# EAGLE design sparkfun-samd21-mini-breakout-v10 (EAGLE 9.2.2)
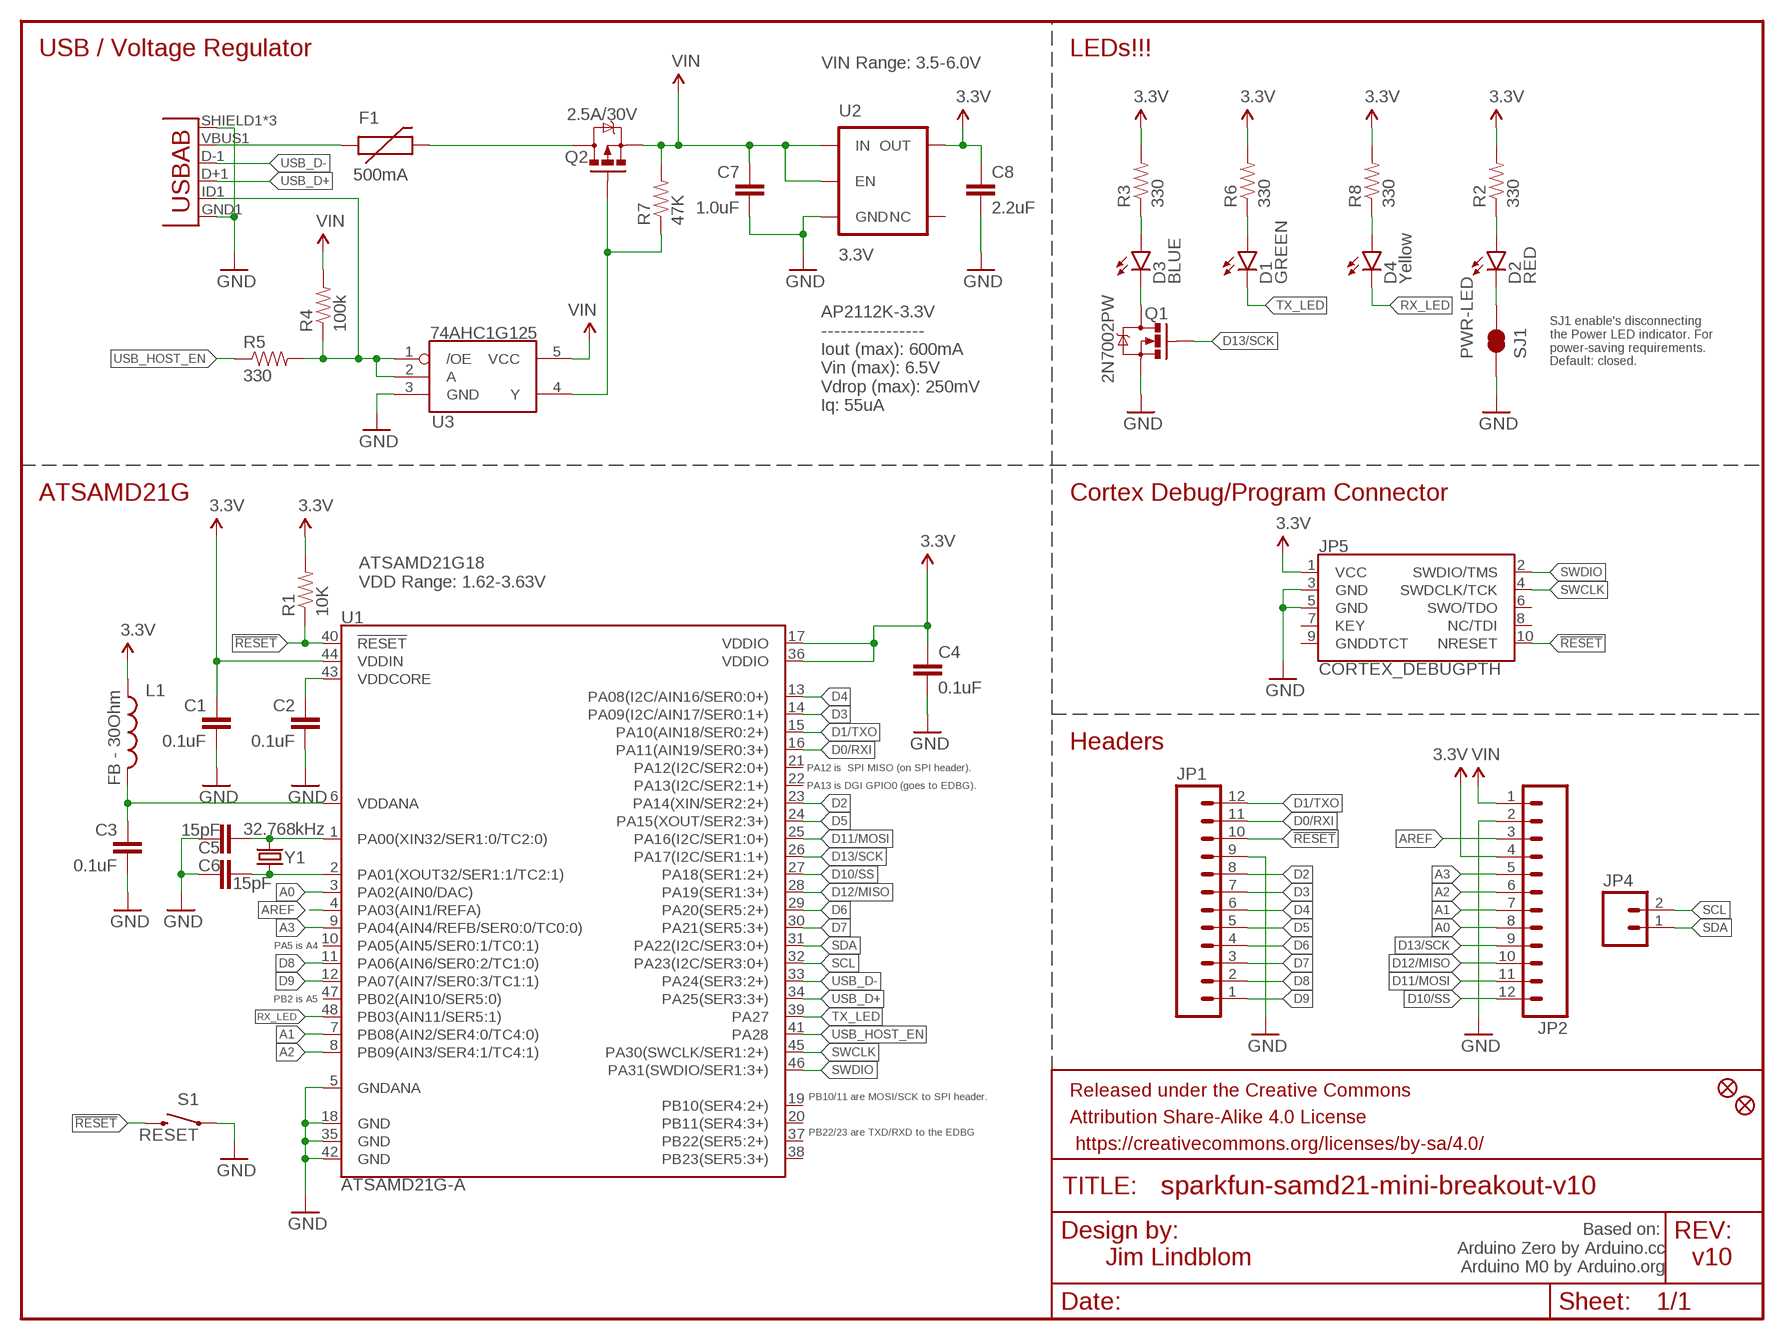
[diagram p0: schematic, sheet 1]

## Parts
C1  0.1uF  0.1UF-16V(+-10%)(0402)  [0402-CAP]
C2  0.1uF  0.1UF-16V(+-10%)(0402)  [0402-CAP]
C3  0.1uF  0.1UF-16V(+-10%)(0402)  [0402-CAP]
C4  0.1uF  0.1UF-16V(+-10%)(0402)  [0402-CAP]
C5  15pF  15PF-50V(+-5%)(0402)  [0402-CAP]
C6  15pF  15PF-50V(+-5%)(0402)  [0402-CAP]
C7  1.0uF  1.0UF-25V-+80/-20(0805)"  [0805-CAP]
C8  2.2uF  2.2UF-10V-20%(0603)  [0603-CAP]
D1  GREEN  LED-GREEN0603  [LED-0603]
D2  RED  LED-RED0603  [LED-0603]
D3  BLUE  LED-BLUE0603  [LED-0603]
D4  Yellow  LED-YELLOW0603  [LED-0603]
F1  500mA  PTCSMD  [PTC-1206]
FID1  FIDUCIAL1X2  [FIDUCIAL-1X2]
FID2  FIDUCIAL1X2  [FIDUCIAL-1X2]
FRAME1  FRAME-LETTER  [CREATIVE_COMMONS]
JP1  M12NO_SILK  [1X12_NO_SILK]
JP2  M12NO_SILK  [1X12_NO_SILK]
JP3  USB-ABCONN-11794  [USB-AB-MICRO-SMD_V03]
JP4  M021X02_NO_SILK  [1X02_NO_SILK]
JP5  CORTEX_DEBUGPTH  [2X5-PTH-1.27MM]
L1  FB - 30Ohm  INDUCTOR0603  [0603]
Q1  2N7002PW  MOSFET-NCHANNEL2N7002PW  [SOT323]
Q2  2.5A/30V  MOSFET-PCHANNELDMG2307L  [SOT23-3]
R1  10K  10KOHM-1/10W-1%(0603)0603  [0603-RES]
R2  330  330OHM1/10W1%(0603)  [0603-RES]
R3  330  330OHM1/10W1%(0603)  [0603-RES]
R4  100k  100KOHM-1/10W-1%(0603)  [0603-RES]
R5  330  330OHM1/10W1%(0603)  [0603-RES]
R6  330  330OHM1/10W1%(0603)  [0603-RES]
R7  47K  47KOHM1/10W1%(0603)  [0603-RES]
R8  330  330OHM1/10W1%(0603)  [0603-RES]
S1  RESET  SWITCH-MOMENTARY-2SMD-4.6X2.8MM  [TACTILE_SWITCH_SMD_4.6X2.8MM]
SJ1  PWR-LED  JUMPER-PAD-2-NC_BY_TRACENO_SILK  [PAD-JUMPER-2-NC_BY_TRACE_NO_SILK]
U1  ATSAMD21G-A  [TQFP-48]
U2  3.3V  V_REG_AP2112K-3.3V  [SOT23-5]
U3  74AHC1G125  [SOT23-5]
Y1  32.768kHz  CRYSTAL3.2X1.5MM  [CRYSTAL-SMD-3.2X1.5MM]

## Nets
3.3V: C1.1 C4.1 C8.1 JP2.4 JP5.1(VCC) L1.1 R1.2 R2.2 R3.2 R6.2 R8.2 U1.17(VDDIO) U1.36(VDDIO) U1.44(VDDIN) U2.5(OUT)
!RESET: JP1.10 JP5.10(NRESET) R1.1 S1.3 S1.4 U1.40(!RESET!)
A0: JP2.8 U1.3(PA02(AIN0/DAC))
A1: JP2.7 U1.7(PB08(AIN2/SER4:0/TC4:0))
A2: JP2.6 U1.8(PB09(AIN3/SER4:1/TC4:1))
A3: JP2.5 U1.9(PA04(AIN4/REFB/SER0:0/TC0:0))
AREF: JP2.3 U1.4(PA03(AIN1/REFA))
D0/RXI: JP1.11 U1.16(PA11(AIN19/SER0:3+))
D1/TXO: JP1.12 U1.15(PA10(AIN18/SER0:2+))
D2: JP1.8 U1.23(PA14(XIN/SER2:2+))
D3: JP1.7 U1.14(PA09(I2C/AIN17/SER0:1+))
D4: JP1.6 U1.13(PA08(I2C/AIN16/SER0:0+))
D5: JP1.5 U1.24(PA15(XOUT/SER2:3+))
D6: JP1.4 U1.29(PA20(SER5:2+))
D7: JP1.3 U1.30(PA21(SER5:3+))
D8: JP1.2 U1.11(PA06(AIN6/SER0:2/TC1:0))
D9: JP1.1 U1.12(PA07(AIN7/SER0:3/TC1:1))
D10/SS: JP2.12 U1.27(PA18(SER1:2+))
D11/MOSI: JP2.11 U1.25(PA16(I2C/SER1:0+))
D12/MISO: JP2.10 U1.28(PA19(SER1:3+))
D13/SCK: JP2.9 Q1.1(G) U1.26(PA17(I2C/SER1:1+))
GND: C1.2 C2.2 C3.2 C4.2 C5.1 C6.2 C7.2 C8.2 JP1.9 JP2.2 JP3.GND1(GND) JP3.SHIELD1(SHIELD) JP3.SHIELD2(SHIELD) JP3.SHIELD3(SHIELD) JP5.3(GND) JP5.5(GND) Q1.2(S) S1.1 S1.2 SJ1.1 U1.5(GNDANA) U1.18(GND) U1.35(GND) U1.42(GND) U2.2(GND) U3.3(GND)
N$1: F1.1 JP3.VBUS1(VBUS)
N$2: C5.2 U1.1(PA00(XIN32/SER1:0/TC2:0)) Y1.P$2
N$3: D3.C Q1.3(D)
N$4: C6.1 U1.2(PA01(XOUT32/SER1:1/TC2:1)) Y1.P$1
N$5: D2.A R2.1
N$6: D3.A R3.1
N$7: F1.2 Q2.3(D)
N$8: JP3.ID1(USBID) R4.1 R5.2 U3.1(/OE) U3.2(A)
N$9: Q2.1(G) R7.1 U3.4(Y)
N$10: D1.A R6.1
N$11: D4.A R8.1
N$12: D2.C SJ1.2
RX_LED: D4.C U1.48(PB03(AIN11/SER5:1))
SCL: JP4.2 U1.32(PA23(I2C/SER3:0+))
SDA: JP4.1 U1.31(PA22(I2C/SER3:0+))
SWCLK: JP5.4(SWDCLK/TCK) U1.45(PA30(SWCLK/SER1:2+))
SWDIO: JP5.2(SWDIO/TMS) U1.46(PA31(SWDIO/SER1:3+))
TX_LED: D1.C U1.39(PA27)
USB_D+: JP3.D+1(D+) U1.34(PA25(SER3:3+))
USB_D-: JP3.D-1(D-) U1.33(PA24(SER3:2+))
USB_HOST_EN: R5.1 U1.41(PA28)
VDDANA: C3.1 L1.2 U1.6(VDDANA)
VDDCORE: C2.1 U1.43(VDDCORE)
VIN: C7.1 JP2.1 Q2.2(S) R4.2 R7.2 U2.1(IN) U2.3(EN) U3.5(VCC)
Unconnected: JP5.6(SWO/TDO) JP5.7(KEY) JP5.8(NC/TDI) JP5.9(GNDDTCT) U1.10(PA05(AIN5/SER0:1/TC0:1)) U1.19(PB10(SER4:2+)) U1.20(PB11(SER4:3+)) U1.21(PA12(I2C/SER2:0+)) U1.22(PA13(I2C/SER2:1+)) U1.37(PB22(SER5:2+)) U1.38(PB23(SER5:3+)) U1.47(PB02(AIN10/SER5:0)) U2.4(NC)

## Notes on the sheet
- USB / Voltage Regulator | LEDs!!!
- VIN Range: 3.5-6.0V
- AP2112K-3.3V
  ----------------
  Iout (max): 600mA 
  Vin (max): 6.5V
  Vdrop (max): 250mV
  Iq: 55uA
- SJ1 enable's disconnecting
  the Power LED indicator. For
  power-saving requirements.
  Default: closed.
- ATSAMD21G | Cortex Debug/Program Connector
- ATSAMD21G18
  VDD Range: 1.62-3.63V
- Headers
- PA12 is  SPI MISO (on SPI header).
- PA13 is DGI GPIO0 (goes to EDBG).
- PA5 is A4
- PB2 is A5
- PB10/11 are MOSI/SCK to SPI header.
- PB22/23 are TXD/RXD to the EDBG
- Based on: 
  Arduino Zero by Arduino.cc
  Arduino M0 by Arduino.org
- Jim Lindblom | v10

## Library data of the parts
C1-C4 = SparkFun-Capacitors:0.1UF-16V(+-10%)(0402); PROD_ID: CAP-12416
C5 C6 = samd21-temp:15PF-50V(+-5%)(0402); PROD_ID: CAP-13063
C7 = SparkFun-Capacitors:1.0UF-25V-+80/-20(0805): CAP-11625; PROD_ID: CAP-11625
C8 = SparkFun-Capacitors:2.2UF-10V-20%(0603): CAP-07888; PROD_ID: CAP-07888
D1 = SparkFun-LED:LED-GREEN: Various green LEDs Green LEDs used in SFE Production 0603- DIO-00821 LARGE- DIO-00862 LILYPAD- DIO-09910; PROD_ID: DIO-00821
D2 = SparkFun-LED:LED-RED: Assorted Red LEDs LilyPad 1206- DIO-09912 1206- DIO-00809 0603- DIO-00819 "SMART" means more efficient and expensive; PROD_ID: DIO-00819
D3 = SparkFun-LED:LED-BLUE: Blue LEDs for production use Various blue LEDs stocked by SparkFun production 0603 - DIO-08575 Rebel - DIO-09553 1206 - DIO-09911; PROD_ID: DIO-08575
D4 = SparkFun-LED:LED-YELLOW: Yellow SMD LEDs LilyPad 1206- DIO-09909 0603- DIO-09003 "SMART" means more efficient and expensive; PROD_ID: DIO-09003
F1 = SparkFun-PowerIC:PTC: Resettable Fuse PTC Resettable Fuse. Spark Fun Electronics SKU : COM-08357; PROD_ID: RES-11150
FID1 FID2 = SparkFun-Aesthetics:FIDUCIAL: Fiducial Alignment Points Various fiducial points for machine vision alignment.
FRAME1 = SparkFun-Aesthetics:FRAME-LETTER: Schematic Frame Standard 8.5x11 US Letter frame
JP1 JP2 = SparkFun-Connectors:M12: Header 12 Standard 12-pin 0.1" header. Use with straight break away headers (SKU : PRT-00116), right angle break away headers (PRT-00553), swiss pins (PRT-00743), machine pins (PRT-00117), and female headers (PRT-00115).
JP3 = SparkFun-Connectors:USB-AB: This is a USB AB connector that is compatible with USB OTG. i.e. this connector can serve as a host or device; PROD_ID: CONN-11794
JP4 = SparkFun-Connectors:M02: Standard 2-pin 0.1" header. Use with - straight break away headers ( PRT-00116) - right angle break away headers (PRT-00553) - swiss pins (PRT-00743) - machine pins (PRT-00117) - female headers (PRT-00115) Molex polarized connector foot print use with: PRT-08233 with associated crimp pins and housings. 2.54_SCREWTERM for use with PRT-10571. 3.5mm Screw Terminal footprints for PRT-08084 5mm Screw Terminal footprints for use with PRT-08432
JP5 = samd21-temp:CORTEX_DEBUG: Cortex Debug Connector Datasheet <http://infocenter.arm.com/help/topic/com.arm.doc.faqs/attached/13634/cortex_debug_connectors.pdf>
L1 = SparkFun-Passives:INDUCTOR: Inductors Basic Inductor/Choke - 0603 and 1206. Footprints are not proven and vary greatly between part numbers. INDUCTOR POWER 3.3UH 4.0A SMD 0.197" L x 0.197" W x 0.177" H (5.00mm x 5.00mm x 4.50mm); PROD_ID: RES-07859
Q1 = SparkFun-DiscreteSemi:MOSFET-NCHANNEL: Common NMOSFET Parts MFG P/N Store ID Prod ID FDD8780 TRANS-09984 SI7820DN TRANS-11055 FDS6630A IC-08089 2N7002PW TRANS-11151 FQP30N06L COM-10213 TRANS-10060 BSS123LT1G TRANS-08345 BSS138 TRANS-00830 BS170 2N7000; PROD_ID: TRANS-11151
Q2 = SparkFun-DiscreteSemi:MOSFET-PCHANNEL: Generic PMOSFET IRLML2244 - TRANS-11153 (SOT-23 -20V -4.3A) (1.Gate 2.Source 3.Drain) FQP27P06 - COM-10349 <http://www.sparkfun.com/products/10349> (TO-220 -60V -27A) (1.Gate 2.Source 3.Drain); PROD_ID: TRANS-11308
R1 = SparkFun-Resistors:10KOHM-1/10W-1%(0603): RES-00824; PROD_ID: RES-00824
R2 R3 R5 R6 R8 = SparkFun-Resistors:330OHM1/10W1%(0603): RES-00818; PROD_ID: RES-00818
R4 = SparkFun-Resistors:100KOHM-1/10W-1%(0603): RES-07828; PROD_ID: RES-07828
R7 = SparkFun-Resistors:47KOHM1/10W1%(0603): RES-07871; PROD_ID: RES-07871
S1 = samd21-temp:SWITCH-MOMENTARY-2: Various NO switches- pushbuttons, reed, etc; PROD_ID: SWCH-13065
SJ1 = SparkFun-Passives:JUMPER-PAD-2-NC_BY_TRACE
U1 = samd21-temp:ATSAMD21G: Atmel SAMD21G SMART ARM-Based Microcontroller The Atmel ® | SMART ™ SAM D21 is a series of low-power microcontrollers using the 32-bit ARM ® Cortex ® -M0+ processor, and ranging from 32- to 64-pins with up to 256KB Flash and 32KB of SRAM. The SAM D21 devices operate at a maximum frequency of 48MHz and reach 2.46 CoreMark/MHz. They are designed for simple and intuitive migration with identical peripheral modules, hex compatible code, identical linear address map and pin compatible migration paths between all devices in the product series. All devices include intelligent and flexible peripherals, Atmel Event System for inter-peripheral signaling, and support for capacitive touch button, slider and wheel user interfaces.; PROD_ID: IC-13064
U2 = SparkFun-PowerIC:V_REG_AP2112: AP2112 - 600mA CMOS LDO Regulator w/ Enable The AP2112 is CMOS process low dropout linear regulator with enable function, the regulator delivers a guaranteed 600mA (min.) continuous load current. Features Output Voltage Accuracy: ±1.5% Output Current: 600mA (Min.) Foldback Short Current Protection: 50mA Enable Function to Turn ON/OFF VOUT Low Dropout Voltage (3.3V): 250mV (Typ.) @IOUT=600mA Excellent Load Regulation: 0.2%/A (Typ.) Excellent Line Regulation: 0.02%/V (Typ.) Low Quiescent Current: 55μA (Typ.) Low Standby Current: 0.01μA (Typ.) Low Output Noise: 50μVRMS PSRR: 100Hz -65dB, 1kHz -65dB OTSD Protection Stable with 1.0μF Flexible Cap: Ceramic, Tantalum and Aluminum Electrolytic Operation Temperature Range: -40°C to 85°C ESD: MM 400V, HBM 4000V; PROD_ID: VREG-12457
U3 = SparkFun-DigitalIC:74AHC1G125: Single bus buffer gate with 3-state output; PROD_ID: IC-11920
Y1 = samd21-temp:CRYSTAL: Various standard crystals. Proven footprints.; PROD_ID: XTAL-13062

## Board
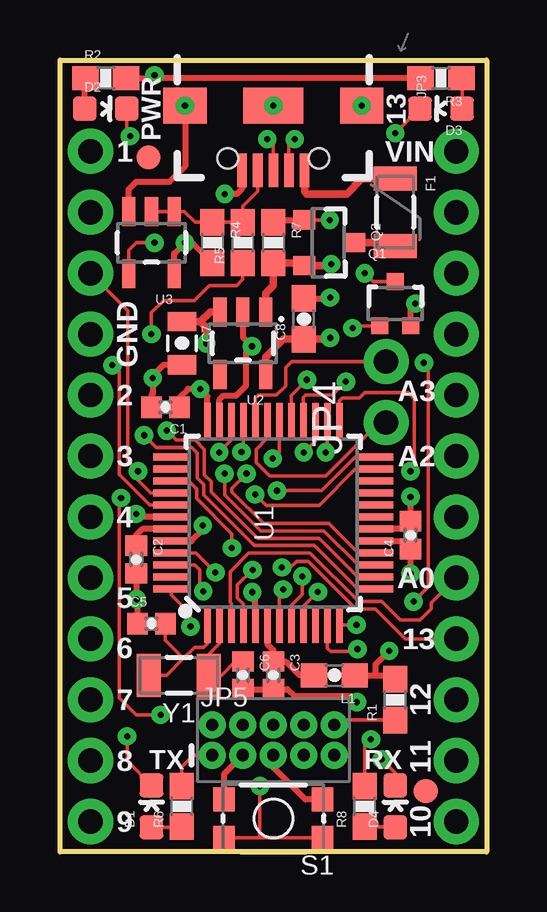
[diagram p1: board, top side]
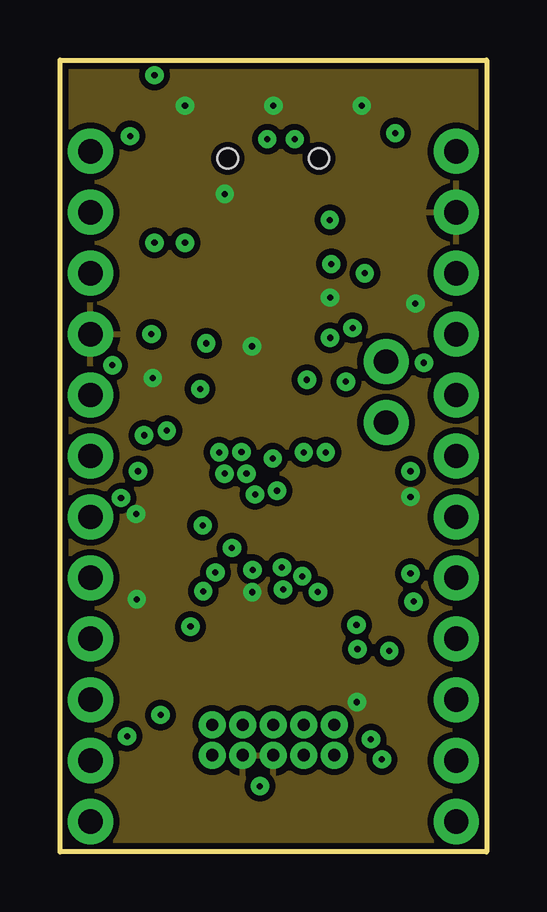
[diagram p2: board, inner layer Route2]
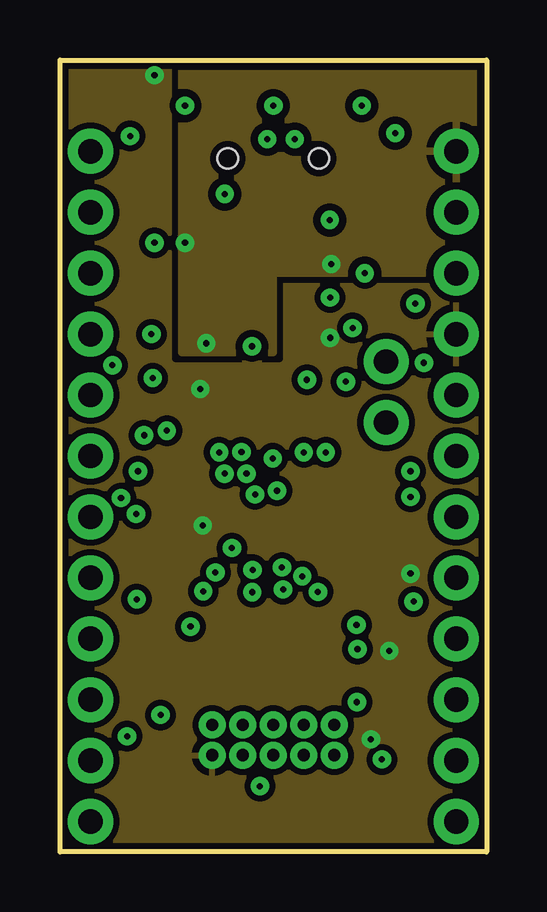
[diagram p3: board, inner layer Route15]
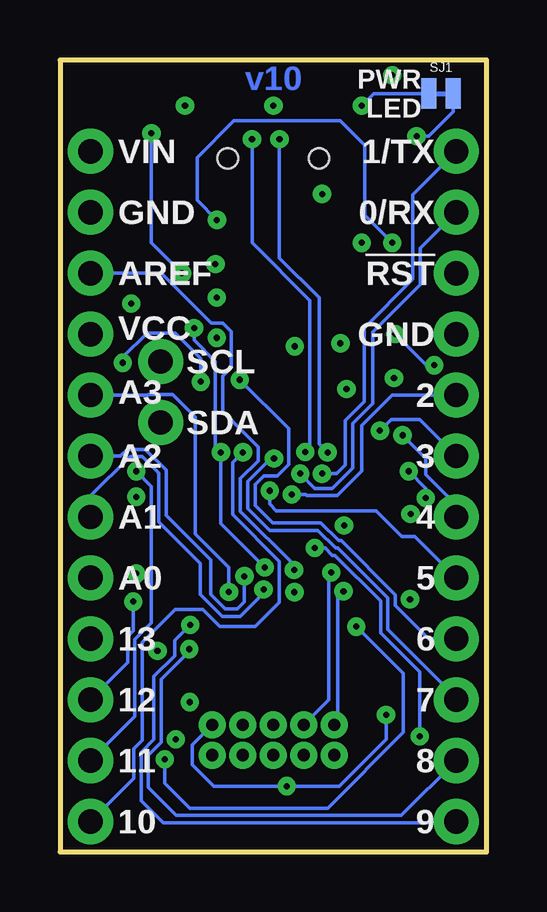
[diagram p4: board, bottom side, seen from below]

Size 17.78 x 33.02 mm. Coordinates in mm from the lower left corner, seen from the top.
Outline: 0,0 0,33.02 17.78,33.02 17.78,0 0,0
Copper layers (1*2*15*16): Top 0.035mm / dielectric 1.5mm / Route2 0.035mm / dielectric 0.15mm / Route15 0.035mm / dielectric 0.2mm / Bottom 0.035mm
Design rules "SparkFun-4-layer *": minimum track width 6mil, minimum drill 10mil, track to track 6mil, track to pad 6mil, pad to pad 6mil, via to via 6mil, smd to smd 6mil, copper to edge 6mil, drill to drill 8mil, minimum pad ring 12mil, minimum via ring 10mil, stop-mask expansion 4mil, vias tented up to drill 20mil, thermal gap 12mil

### Footprints (pad centres in the part's own frame; a part is rotated, then mirrored left to right if it is on the bottom)
0402-CAP = smd 0.85 x 0.9: 1 -0.58,0; 2 0.58,0
0805-CAP = smd 0.8 x 1.2: 1 -0.9,0; 2 0.9,0
0603-CAP = smd 1.1 x 1: 1 -0.85,0; 2 0.85,0
LED-0603 = smd 1 x 1: A 0,-0.877; C 0,0.877
PTC-1206 = smd 1 x 1.8: 1 -1.4,0; 2 1.4,0
FIDUCIAL-1X2 = smd 1 x 1: 1 0,0
1X12_NO_SILK = drill 1.016 pad 1.88: 1 0,0; 2 2.54,0; 3 5.08,0; 4 7.62,0; 5 10.16,0; 6 12.7,0; 7 15.24,0; 8 17.78,0; 9 20.32,0; 10 22.86,0; 11 25.4,0; 12 27.94,0
USB-AB-MICRO-SMD_V03 = smd 1.4 x 0.4: D+1 2.7,0; D-1 2.7,0.65; GND1 2.7,-1.3; ID1 2.7,-0.65; VBUS1 2.7,1.3 | smd 1.5 x 1.8: SHIELD1 0,3.68; SHIELD3 0,-3.68 | smd 1.5 x 2.5: SHIELD2 0,0 | hole 0.85: 2.2,1.9; 2.2,-1.9
1X02_NO_SILK = drill 1.016 pad 1.88: 1 0,0; 2 2.54,0
2X5-PTH-1.27MM = drill 0.508 pad 1: 1 -2.54,-0.635; 2 -2.54,0.635; 3 -1.27,-0.635; 4 -1.27,0.635; 5 0,-0.635; 6 0,0.635; 7 1.27,-0.635; 8 1.27,0.635; 9 2.54,-0.635; 10 2.54,0.635
0603 = smd 1.1 x 1: 1 -0.85,0; 2 0.85,0
SOT323 = smd 0.7 x 0.7: 1 -0.65,-0.925; 2 0.65,-0.925; 3 0,0.925
SOT23-3 = smd 0.8 x 0.9: 1 -0.95,-1; 2 0.95,-1; 3 0,1.1
0603-RES = smd 1.1 x 1: 1 -0.85,0; 2 0.85,0
TACTILE_SWITCH_SMD_4.6X2.8MM = smd 0.9 x 1: 1 -2.05,-0.8; 2 2.05,-0.8; 3 2.05,0.8; 4 -2.05,0.8
PAD-JUMPER-2-NC_BY_TRACE_NO_SILK = smd 0.635 x 1.27: 1 -0.508,0; 2 0.508,0
TQFP-48 = smd 1.5 x 0.28: 1 -4.25,2.75; 2 -4.25,2.25; 3 -4.25,1.75; 4 -4.25,1.25; 5 -4.25,0.75; 6 -4.25,0.25; 7 -4.25,-0.25; 8 -4.25,-0.75; 9 -4.25,-1.25; 10 -4.25,-1.75; 11 -4.25,-2.25; 12 -4.25,-2.75; 25 4.25,-2.75; 26 4.25,-2.25; 27 4.25,-1.75; 28 4.25,-1.25; 29 4.25,-0.75; 30 4.25,-0.25; 31 4.25,0.25; 32 4.25,0.75; 33 4.25,1.25; 34 4.25,1.75; 35 4.25,2.25; 36 4.25,2.75 | smd 0.28 x 1.5: 13 -2.75,-4.25; 14 -2.25,-4.25; 15 -1.75,-4.25; 16 -1.25,-4.25; 17 -0.75,-4.25; 18 -0.25,-4.25; 19 0.25,-4.25; 20 0.75,-4.25; 21 1.25,-4.25; 22 1.75,-4.25; 23 2.25,-4.25; 24 2.75,-4.25; 37 2.75,4.25; 38 2.25,4.25; 39 1.75,4.25; 40 1.25,4.25; 41 0.75,4.25; 42 0.25,4.25; 43 -0.25,4.25; 44 -0.75,4.25; 45 -1.25,4.25; 46 -1.75,4.25; 47 -2.25,4.25; 48 -2.75,4.25
SOT23-5 = smd 0.55 x 1.2: 1 -0.95,-1.3; 2 0,-1.3; 3 0.95,-1.3; 4 0.95,1.3; 5 -0.95,1.3
CRYSTAL-SMD-3.2X1.5MM = smd 1 x 1.8: P$1 -1.25,0; P$2 1.25,0

### Placement (x,y rotation side)
C1  4.39,18.54 180 top
C2  3.17,12.19 270 top
C3  8.89,7.37 270 top
C4  14.61,13.21 90 top
C5  3.81,9.53 0 top
C6  7.62,7.37 270 top
C7  5.08,21.21 270 top
C8  10.16,22.23 90 top
D1  3.81,1.91 0 top
D2  1.91,30.99 270 top
D3  15.88,30.99 90 top
D4  13.97,1.91 0 top
F1  13.97,26.67 270 top
FID1  15.24,2.54 0 top
FID2  3.68,28.96 0 top
FRAME1  -12.7,-19.05 0 top  (outside the outline)
JP1  1.27,1.27 90 top
JP2  16.51,29.21 270 top
JP3  8.89,31.11 270 top
JP4  13.59,17.91 90 top
JP5  8.89,4.67 0 top
L1  11.43,7.37 180 top
Q1  13.97,22.86 0 top
Q2  11.18,25.4 270 top
R1  13.97,6.35 90 top
R2  1.91,32.26 0 top
R3  15.88,32.26 180 top
R4  6.35,25.4 270 top
R5  7.62,25.4 90 top
R6  5.08,1.91 90 top
R7  8.89,25.4 270 top
R8  12.7,1.91 90 top
S1  8.89,1.4 180 top
SJ1  1.91,31.62 0 bottom
U1  8.89,13.72 90 top
U2  7.62,21.21 180 top
U3  3.81,25.4 180 top
Y1  4.95,7.37 180 top

### Tracks (layer width: path | path; a pad name or v marks a point on that pad's centre or on a via)
3.3V  (via drill 0.25)
  Top 0.152: R6.2 5.08,3.56 5.56,4.04 JP5.1 | R8.2 12.7,4.45 v12.95,4.7
  Top 0.254: U1.36 6.14,19.01 v5.84,19.3 5.33,19.3 4.97,18.94 C1.1 | U1.17 14.27,12.97 C4.1 v14.61,11.61 | R2.2 3.81,32.26 v3.94,32.38 4.06,32.26 R3.2 | L1.1 13.14,7.37 | 13.14,7.37 13.8,7.37 R1.2 | U1.44 5.47,12.97 5.94,13.44 v5.94,13.61 | v13.72,8.38 13.14,7.81 13.14,7.37
  Top 0.305: U2.5 8.57,20.64 9.31,21.38 C8.1 11.19,21.38 v11.25,21.44
  pour Route15 (isolate 0.254, rank 3): 0,33.02 0,0 17.78,0 17.78,33.02
!RESET  (via drill 0.25)
  Top 0.152: U1.40 3.78,14.97 3.25,15.49 v3.25,15.88 2.82,16.31 2.82,22.58 JP1.10 | v2.54,14.76 2.46,14.68 2.46,6.43 3.17,5.71 v4.19,5.71 | R1.1 11.62,5.5 JP5.10 | v8.33,2.74 8.33,0.6 | 8.33,0.6 S1.4 | 8.33,0.6 S1.3
  Bottom 0.152: v2.54,14.76 2.54,15.16 v3.25,15.88 | JP5.10 12.27,4.47 12.27,3.63 11.38,2.74 v8.33,2.74 6.15,2.74 4.19,4.7 v4.19,5.71
A0
  Top 0.152: JP2.8 15.47,10.39 15.47,10.13 15.01,9.68 14.17,9.68 13.41,10.44 12.45,10.44 10.41,12.47 7.87,12.47 7.09,11.68 7.09,10.41 7.14,10.36 U1.3
A1  (via drill 0.25)
  Top 0.152: U1.7 9.14,10.79 v9.3,10.95
  Bottom 0.152: JP2.7 16.51,14.83 14.86,16.48 14.35,16.48 13.66,15.8 13.66,13.77 11.94,12.04 11.94,10.74 11.02,9.83 10.26,9.83 9.3,10.79 v9.3,10.95
A2  (via drill 0.25)
  Top 0.152: U1.8 9.64,10.29 10.1,10.74 v10.1,11.49
  Bottom 0.152: v10.1,11.49 10.1,10.43 10.39,10.13 10.9,10.13 11.51,10.74 11.51,12.17 13.36,14.02 13.36,15.93 14.22,16.79 14.99,16.79 15.27,16.51 JP2.6
A3  (via drill 0.25)
  Top 0.152: v10.74,10.85 10.14,10.24 U1.9
  Bottom 0.152: v10.74,10.85 10.74,11.86 12.14,13.26 12.14,18.14 13.08,19.07 14.1,19.07 14.12,19.05 JP2.5
AREF  (via drill 0.25)
  Top 0.152: v8.03,11.76 7.39,11.12 7.39,10.59 7.64,10.34 7.64,10.33 U1.4
  Bottom 0.152: JP2.3 13.56,24.13 11.48,22.05 11,22.05 10.64,21.69 10.64,20.19 11,19.84 11,18.36 9.53,16.89 9.53,16.31 10.26,15.57 10.26,14.2 8.03,11.96 v8.03,11.76
D0/RXI  (via drill 0.25)
  Top 0.152: U1.16 12.43,12.47 11.2,13.69 8.48,13.69 7.16,15.01 7.16,15.16 v7.77,15.77
  Bottom 0.152: v7.77,15.77 7.16,15.16 6.43,15.16 5.59,16 5.59,17.86 4.75,18.69 4.75,21.67 2.77,23.65 2.77,25.17 JP1.11
D1/TXO  (via drill 0.25)
  Top 0.152: U1.15 12.42,11.97 11,13.39 8.36,13.39 6.86,14.88 v6.86,15.77
  Bottom 0.152: v6.86,15.77 6.25,15.77 5.89,16.13 5.89,17.98 5.11,18.77 5.11,21.84 3.07,23.88 3.07,27.41 JP1.12
D2  (via drill 0.25)
  Top 0.152: U1.23 12.31,15.97 10.79,14.45 8.59,14.45 v8.13,14.91
  Bottom 0.152: JP1.8 3.94,19.05 5.21,17.78 5.21,15.88 6.22,14.86 7.49,14.86 7.54,14.91 v8.13,14.91
D3  (via drill 0.25)
  Top 0.152: v4.45,17.57 4.85,17.17 5.64,17.17 6.02,16.79 6.02,15.72 6.3,15.44 6.3,15.01 8.23,13.08 10.79,13.08 12.41,11.47 U1.14
  Bottom 0.152: v4.45,17.57 3.98,18.03 2.79,18.03 JP1.7
D4  (via drill 0.25)
  Top 0.152: U1.13 12.4,10.97 10.59,12.78 8.1,12.78 5.99,14.88 5.99,15.32 5.71,15.6 5.71,16.64 5.49,16.87 4.01,16.87 v3.5,17.37
  Bottom 0.152: v3.5,17.37 2.54,16.41 2.54,15.75 1.27,14.48 JP1.6
D5  (via drill 0.25)
  Top 0.152: U1.24 12.3,16.47 10.9,15.06 v9.04,15.06
  Bottom 0.152: JP1.5 3,13.16 3.53,13.16 4.6,14.22 8.76,14.22 9.04,14.5 v9.04,15.06
D6  (via drill 0.25)
  Top 0.152: U1.29 9.64,19.04 v10.29,19.68
  Bottom 0.152: JP1.4 2.41,8.89 3.81,10.29 3.81,10.72 6.07,12.98 6.17,12.98 6.91,13.72 8.91,13.72 9.65,14.45 9.65,15.32 9.3,15.67 8.74,15.67 8.26,16.15 8.26,17.65 v10.29,19.68
D7  (via drill 0.25)
  Top 0.152: U1.30 9.14,16.68 v8.87,16.41
  Bottom 0.152: JP1.3 1.27,6.43 4.12,9.27 4.12,10.59 6.2,12.68 6.3,12.68 7.04,13.41 9.04,13.41 9.96,14.33 9.96,15.44 8.99,16.41 v8.87,16.41
D8  (via drill 0.25)
  Top 0.152: U1.11 11.14,8.49 11.28,8.36 12.29,8.36 v12.39,8.46
  Bottom 0.152: JP1.2 3.56,1.52 12.93,1.52 14.1,2.69 14.1,4.04 13.56,4.57 13.56,7.19 12.39,8.36 v12.39,8.46
D9  (via drill 0.25)
  Top 0.152: U1.12 v12.35,9.47
  Bottom 0.152: JP1.1 1.32,1.22 13.49,1.22 14.4,2.13 14.4,4.17 13.87,4.7 13.87,7.32 13.01,8.18 13.01,8.81 v12.35,9.47
D10/SS  (via drill 0.25)
  Top 0.152: U1.27 10.64,17.14 v10.16,16.66
  Bottom 0.152: JP2.12 14.71,3.07 14.71,4.29 14.35,4.65 14.35,8.74 12.98,10.11 11.84,10.11 11.12,9.4 9.65,9.4 8.64,10.41 8.64,12.12 10.59,14.07 10.59,16.23 v10.16,16.66
D11/MOSI  (via drill 0.25)
  Top 0.152: U1.25 11.64,18.8 11.76,18.92 12.47,18.92 12.7,19.15 14.5,19.15 14.76,18.9 14.76,16.03 v14.61,15.88
  Bottom 0.152: JP2.11 14.66,5.66 14.66,8.87 13.97,9.55 13.97,15.24 v14.61,15.88
D12/MISO  (via drill 0.25)
  Top 0.152: U1.28 10.14,18.95 10.24,19.05 11.35,19.05 v11.91,19.61 | v15.16,20.4 15.34,20.22 15.34,11.05 v14.73,10.44
  Bottom 0.152: v11.91,19.61 11.91,20.57 12.98,21.64 14.15,21.64 15.16,20.62 v15.16,20.4 | JP2.10 14.96,7.9 14.96,8.99 14.73,9.22 v14.73,10.44
D13/SCK  (via drill 0.25)
  Top 0.152: U1.26 11.14,16.73 v11.07,16.66 | JP2.9 14.38,8.89 13.13,10.13 12.32,10.13 10.34,12.12 9.86,12.12 9.6,11.86 v9.25,11.86 | Q1.1 12.28,21.93 v12.19,21.84
  Bottom 0.152: v12.19,21.84 12.19,21.34 11.3,20.45 11.3,16.89 v11.07,16.66 11.07,13.69 v9.25,11.86
GND  (via drill 0.25)
  Top 0.152: v3.87,19.76 3.87,19.87 | 3.17,10.56 v3.2,10.54 | C1.2
  Top 0.254: U2.2 7.62,21.46 v8,21.08 7.75,20.83 7.75,19.43 7.34,19.02 6.81,19.02 6.64,18.86 U1.35 | C7.2 4.31,20.31 3.87,19.87 | JP3.GND1 7.59,27.66 7.37,27.43 v6.86,27.43 | C6.2 C3.2 9.47,6.79 9.75,6.5 12.12,6.5 v12.37,6.25 | C8.2 11.21,23.07 v11.25,23.11 | C2.2 3.17,10.56 | C5.1 3.23,10.5 v3.2,10.54 | U1.5 8.14,10.71 v8.01,10.83 | v3.87,19.76 3.87,19.11 3.81,19.05 C1.2 | U1.42 3.3,13.97 v3.17,14.09 | U1.18 14.28,13.47 C4.2 v14.61,14.81 | 5.08,30.99 JP3.SHIELD3 5.21,28.58 4.57,27.94 3.17,27.94 2.86,27.62 U3.3 | Q1.2 14.62,22.67 v14.81,22.86 | JP5.3 6.84,3.26 S1.2 | S1.1 10.22,2.2 8.89,3.53 JP5.5
  Bottom 0.152: SJ1.1 4.7,31.62 JP3.SHIELD3
  other vias: 12.57,31.11 8.89,31.11 5.21,31.11
  pour Route2 (isolate 0.254): 0,33.02 0,0 17.78,0 17.78,33.02
N$1
  Top 0.305: JP3.VBUS1 10.19,27.53 10.29,27.43 11.94,27.43 12.58,28.07 F1.1
N$2
  Top 0.152: Y1.P$2 4.45,7.37 5.14,8.06 | 5.14,8.06 5.61,8.53 5.99,8.53 6.14,8.68 U1.1 | C5.2 4.39,8.82 5.14,8.06
N$3  (via drill 0.25)
  Top 0.152: Q1.3 13.04,23.79 v12.7,24.13 | v13.97,29.97 v13.97,29.96 D3.C
  Bottom 0.152: v12.7,24.13 13.97,25.4 v13.97,29.97
N$4
  Top 0.152: C6.1 7.31,7.95 6.73,7.37 Y1.P$1 6.2,8.23 6.64,8.67 U1.2
N$5
  Top 0.254: D2.A 1.03,32.23 R2.1
N$6
  Top 0.152: D3.A 16.75,32.23
  Top 0.254: 16.75,32.23 R3.1
N$7
  Top 0.254: 13.84,25.4 F1.2
  Top 0.305: Q2.3 13.84,25.4
N$8
  Top 0.152: JP3.ID1 8.24,27.54 7.62,26.92 R5.2 R4.1 5.63,26.25 5.18,26.7 U3.1 U3.2
N$9  (via drill 0.25)
  Top 0.152: U3.4 2.86,25.09 3.17,25.4 v3.94,25.4 | 8.99,26.35 R7.1 | v11.24,26.35 Q2.1
  Top 0.254: 8.99,26.35 Q2.1
  Bottom 0.152: v11.24,26.35 12.06,27.17 12.06,28.96 10.54,30.48 6.1,30.48 5.08,29.46 5.08,26.54 v3.94,25.4
N$10
  Top 0.152: D1.A 5.05,1.03 R6.1
N$11
  Top 0.152: R8.1 13.94,1.05 D4.A
N$12  (via drill 0.25)
  Top 0.152: D2.C 2.78,29.98 v2.92,29.84
  Bottom 0.152: v2.92,29.84 2.41,29.84 1.4,30.86 SJ1.2
RX_LED  (via drill 0.25)
  Top 0.152: v5.44,9.4 5.44,9.93 4.64,10.73 U1.48 | D4.C 13.97,3.3 v13.41,3.86
  Bottom 0.152: v5.44,9.4 3.48,7.44 3.48,4.98 6.63,1.83 12.37,1.83 13.41,2.87 v13.41,3.86
SCL
  Top 0.152: U1.32 8.14,18.93 8.26,19.05 9.02,19.05 9.4,19.43 9.4,20.19 9.65,20.45 JP4.2
SDA
  Top 0.152: U1.31 8.64,17.25 8.18,16.79 8.18,16.23 8.74,15.67 11.07,15.67 13.31,17.91 JP4.1
SWCLK  (via drill 0.25)
  Top 0.152: U1.45 5.66,12.47 v6.48,11.65
  Bottom 0.152: JP5.4 6.58,6.35 6.58,11.53 6.48,11.63 v6.48,11.65
SWDIO  (via drill 0.25)
  Top 0.152: U1.46 5.61,11.97 5.82,11.76 5.82,11.02 v5.97,10.87
  Bottom 0.152: JP5.2 6.2,5.46 6.2,10.64 v5.97,10.87
TX_LED  (via drill 0.25)
  Top 0.152: U1.39 5.36,15.47 5.69,15.14 5.69,14.73 7.16,13.26 v7.16,12.68 | v2.79,4.83 2.79,3.8 D1.C
  Bottom 0.152: v7.16,12.68 6.73,12.68 6.43,12.37 6.33,12.37 4.42,10.46 4.42,9.14 2.79,7.52 v2.79,4.83
USB_D+  (via drill 0.25)
  Top 0.152: JP3.D+1 8.89,29.46 v8.64,29.72 | U1.34 7.14,17.17 v6.63,16.66
  Bottom 0.152: v8.64,29.72 8.64,24.77 6.99,23.11 6.99,17.02 v6.63,16.66
USB_D-  (via drill 0.25)
  Top 0.152: JP3.D-1 9.54,29.48 v9.78,29.72 | U1.33 7.64,16.75 v7.56,16.68
  Bottom 0.152: v9.78,29.72 9.78,25.4 7.37,22.99 7.37,16.87 v7.56,16.68
USB_HOST_EN  (via drill 0.25)
  Top 0.152: R5.1 7.62,23.88 7.37,23.62 6.22,23.62 5.59,22.99 4.32,22.99 3.81,22.48 v3.81,21.59 | v2.18,20.3 2.46,20.02 2.46,15.75 3.75,14.47 U1.41
  Bottom 0.152: v2.18,20.3 2.52,20.3 v3.81,21.59
VDDANA
  Top 0.254: U1.6 8.64,8.66 8.89,8.41 C3.1 9.4,7.95 9.98,7.37 L1.2
VDDCORE
  Top 0.254: U1.43 3.43,13.47 3.17,13.21 C2.1
VIN  (via drill 0.25)
  Top 0.152: C7.1 5.07,22.1
  Top 0.254: U3.5 4.76,24.95 v5.21,25.4 5.5,25.4 R4.2
  Top 0.305: U2.1 8.57,23.3 8.89,23.62 R7.2 10.08,24.55 Q2.2 11.24,24.45 v11.3,24.51 | C7.1 5.85,22.11 | 5.85,22.11 6.25,22.51 U2.3 | v6.1,21.21 6.1,21.87 5.85,22.11
  pour Route15 (isolate 0.305, rank 2): 5.08,33.02 5.08,20.83 8.89,20.83 8.89,24.13 17.78,24.13 17.78,33.02

### Text on the board
Bottom: v10
tPlace: PWR | 13 | 1 | VIN | GND | 2 | A3 | 3 | A2 | 4 | 5 | A0 | 6 | 13 | 7 | 12 | 8 | 11 | TX | RX | 9 | 10
bPlace: PWR / LED | 1/TX | VIN | 0/RX | GND | !RST | AREF | GND | VCC | SCL | 2 | A3 | SDA | 3 | A2 | 4 | A1 | 5 | A0 | 6 | 13 | 7 | 12 | 8 | 11 | 9 | 10
Measures: Units in inches
tDocu: This is a 4-layer board! | Jim Lindblom